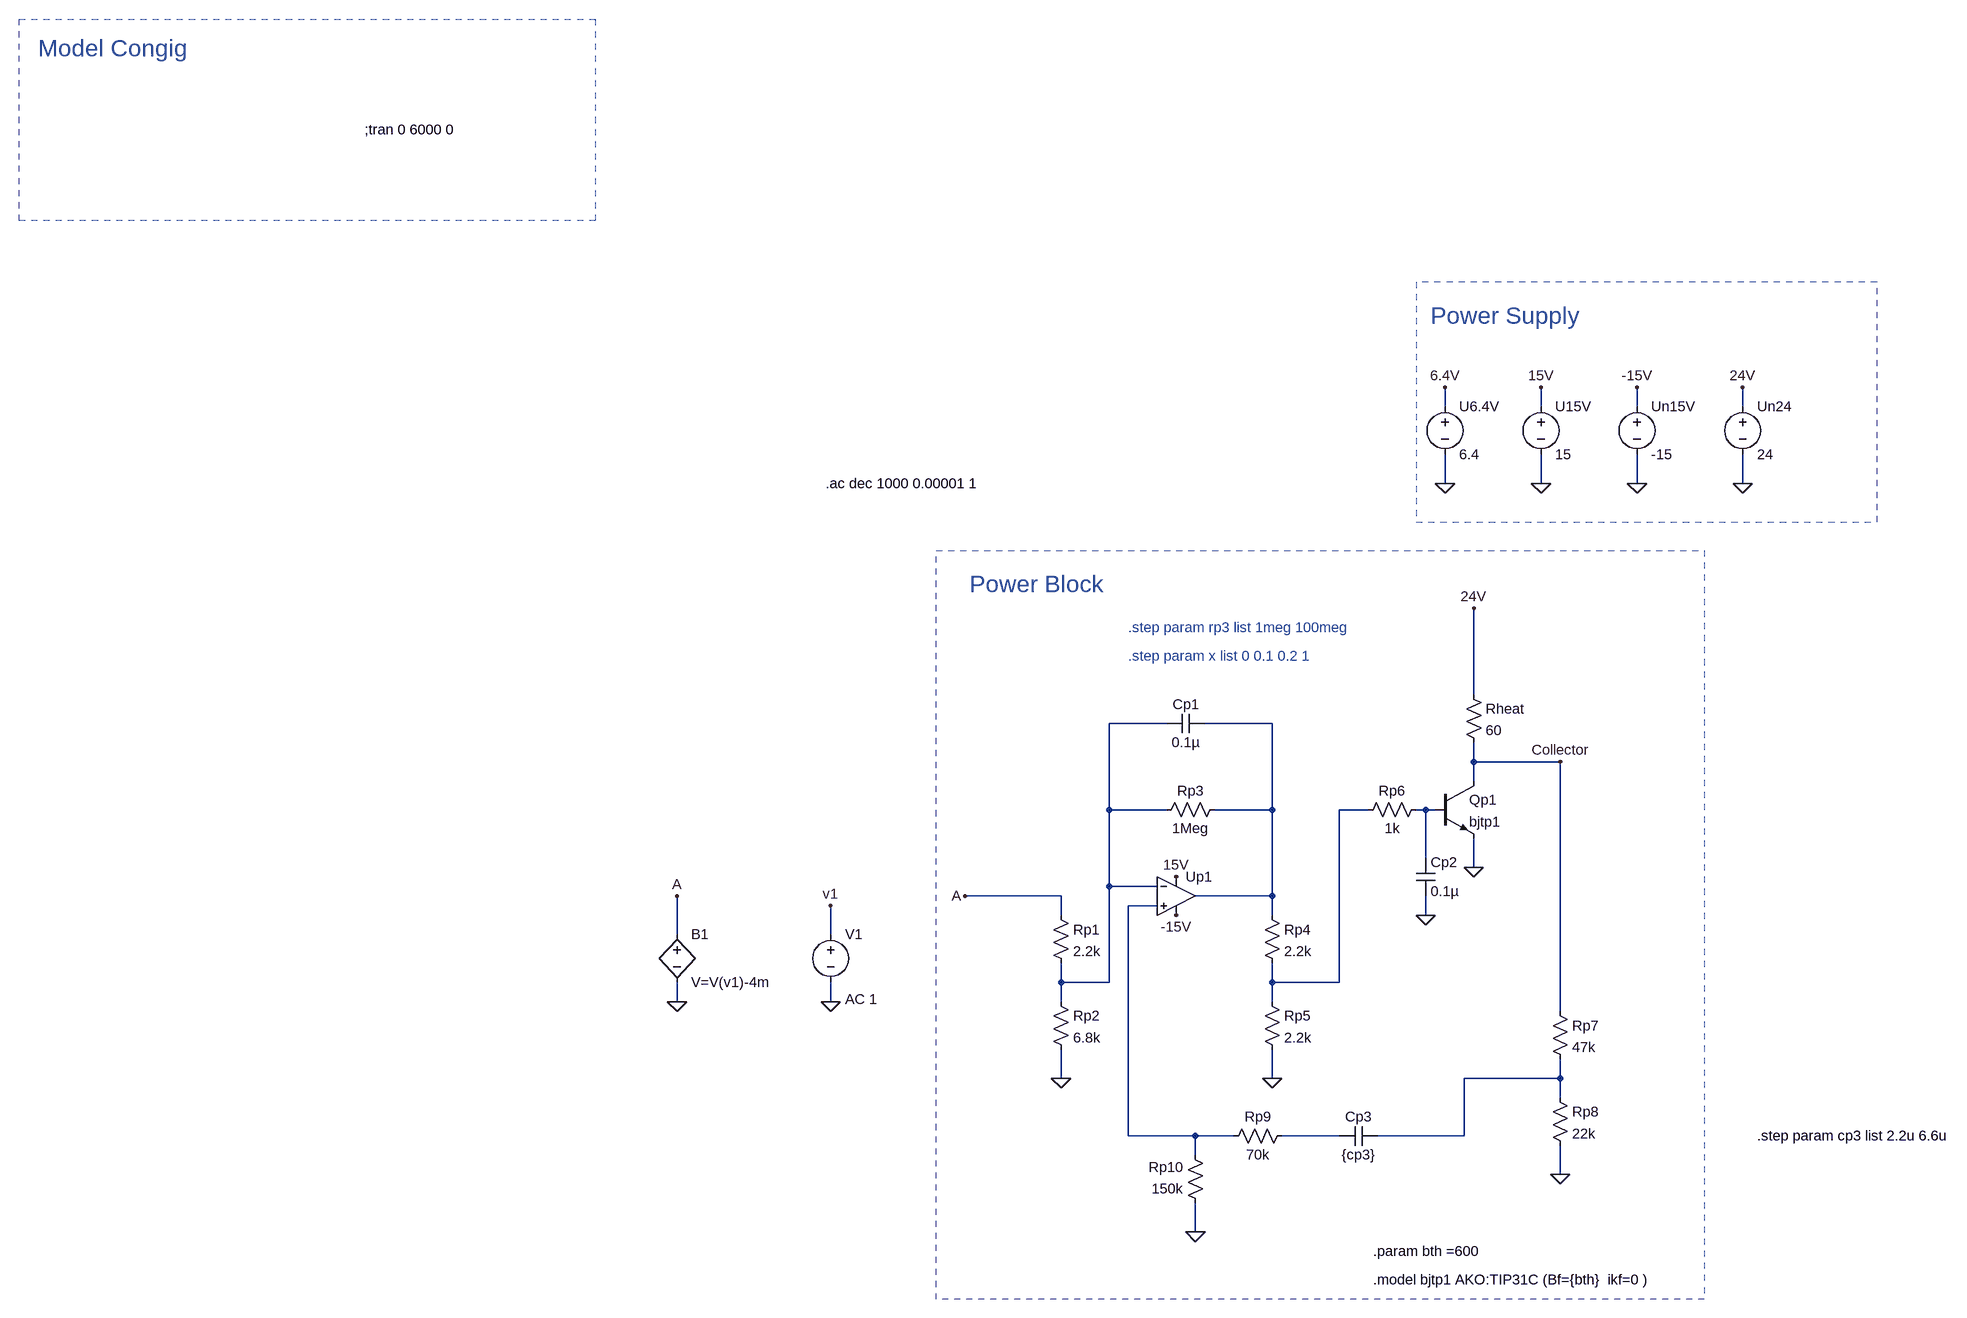
[diagram p0: schematic power_block_frequency_response.asc]
power_block_frequency_response.asc, the LTspice schematic file:
Version 4
SHEET 1 1512 1684
WIRE -208 -416 -208 -448
WIRE -48 -416 -48 -448
WIRE 112 -416 112 -448
WIRE 288 -416 288 -448
WIRE -208 -288 -208 -336
WIRE -48 -288 -48 -336
WIRE 112 -288 112 -336
WIRE 288 -288 288 -336
WIRE -160 64 -160 -80
WIRE -672 112 -768 112
WIRE -496 112 -608 112
WIRE -160 176 -160 144
WIRE -16 176 -160 176
WIRE -160 208 -160 176
WIRE -768 256 -768 112
WIRE -672 256 -768 256
WIRE -496 256 -496 112
WIRE -496 256 -592 256
WIRE -336 256 -384 256
WIRE -240 256 -256 256
WIRE -224 256 -240 256
WIRE -240 336 -240 256
WIRE -160 352 -160 304
WIRE -768 384 -768 256
WIRE -688 384 -768 384
WIRE -848 400 -1008 400
WIRE -496 400 -496 256
WIRE -496 400 -624 400
WIRE -688 416 -736 416
WIRE -848 432 -848 400
WIRE -496 432 -496 400
WIRE -240 432 -240 400
WIRE -1488 464 -1488 400
WIRE -1232 464 -1232 416
WIRE -848 544 -848 512
WIRE -768 544 -768 384
WIRE -768 544 -848 544
WIRE -496 544 -496 512
WIRE -384 544 -384 256
WIRE -384 544 -496 544
WIRE -1488 576 -1488 544
WIRE -1232 576 -1232 544
WIRE -848 576 -848 544
WIRE -496 576 -496 544
WIRE -16 592 -16 176
WIRE -848 704 -848 656
WIRE -496 704 -496 656
WIRE -16 704 -16 672
WIRE -16 704 -176 704
WIRE -16 736 -16 704
WIRE -736 800 -736 416
WIRE -624 800 -736 800
WIRE -560 800 -624 800
WIRE -384 800 -480 800
WIRE -176 800 -176 704
WIRE -176 800 -320 800
WIRE -624 832 -624 800
WIRE -16 864 -16 816
WIRE -624 960 -624 912
FLAG -208 -288 0
FLAG -208 -448 6.4V
FLAG -48 -288 0
FLAG -48 -448 15V
FLAG 112 -288 0
FLAG 112 -448 -15V
FLAG -848 704 0
FLAG -656 432 -15V
FLAG -656 368 15V
FLAG -496 704 0
FLAG -160 352 0
FLAG 288 -288 0
FLAG 288 -448 24V
FLAG -16 864 0
FLAG -624 960 0
FLAG -240 432 0
FLAG -16 176 Collector
FLAG -160 -80 24V
FLAG -1232 576 0
FLAG -1232 416 v1
FLAG -1488 576 0
FLAG -1488 400 A
FLAG -1008 400 A
DATAFLAG -496 128 ""
DATAFLAG -16 320 ""
DATAFLAG -848 544 ""
DATAFLAG -16 704 ""
SYMBOL voltage -208 -432 R0
WINDOW 123 0 0 Left 0
WINDOW 39 0 0 Left 0
SYMATTR InstName U6.4V
SYMATTR Value 6.4
SYMBOL voltage -48 -432 R0
WINDOW 123 0 0 Left 0
WINDOW 39 0 0 Left 0
SYMATTR InstName U15V
SYMATTR Value 15
SYMBOL voltage 112 -432 R0
WINDOW 123 0 0 Left 0
WINDOW 39 0 0 Left 0
SYMATTR InstName Un15V
SYMATTR Value -15
SYMBOL res -864 416 R0
SYMATTR InstName Rp1
SYMATTR Value 2.2k
SYMBOL res -864 560 R0
SYMATTR InstName Rp2
SYMATTR Value 6.8k
SYMBOL res -576 240 R90
WINDOW 0 0 56 VBottom 2
WINDOW 3 32 56 VTop 2
SYMATTR InstName Rp3
SYMATTR Value 1Meg
SYMBOL res -512 416 R0
SYMATTR InstName Rp4
SYMATTR Value 2.2k
SYMBOL res -512 560 R0
SYMATTR InstName Rp5
SYMATTR Value 2.2k
SYMBOL res -176 48 R0
SYMATTR InstName Rheat
SYMATTR Value 60
SYMBOL voltage 288 -432 R0
WINDOW 123 0 0 Left 0
WINDOW 39 0 0 Left 0
SYMATTR InstName Un24
SYMATTR Value 24
SYMBOL res -32 576 R0
SYMATTR InstName Rp7
SYMATTR Value 47k
SYMBOL res -32 720 R0
SYMATTR InstName Rp8
SYMATTR Value 22k
SYMBOL res -464 784 R90
WINDOW 0 0 56 VBottom 2
WINDOW 3 32 56 VTop 2
SYMATTR InstName Rp9
SYMATTR Value 70k
SYMBOL res -608 928 R180
WINDOW 0 36 76 Left 2
WINDOW 3 36 40 Left 2
SYMATTR InstName Rp10
SYMATTR Value 150k
SYMBOL res -240 240 R90
WINDOW 0 0 56 VBottom 2
WINDOW 3 32 56 VTop 2
SYMATTR InstName Rp6
SYMATTR Value 1k
SYMBOL cap -320 784 R90
WINDOW 0 0 32 VBottom 2
WINDOW 3 32 32 VTop 2
SYMATTR InstName Cp3
SYMATTR Value {cp3}
SYMBOL cap -608 96 R90
WINDOW 0 0 32 VBottom 2
WINDOW 3 32 32 VTop 2
SYMATTR InstName Cp1
SYMATTR Value 0.1µ
SYMBOL cap -256 336 R0
SYMATTR InstName Cp2
SYMATTR Value 0.1µ
SYMBOL npn -224 208 R0
SYMATTR InstName Qp1
SYMATTR Value bjtp1
SYMBOL Opamps\\UniversalOpamp2 -656 400 R0
SYMATTR InstName Up1
SYMATTR Value2 Avol=250k GBW=10Meg Slew=10Meg
SYMBOL voltage -1232 448 R0
WINDOW 123 24 124 Left 2
WINDOW 39 0 0 Left 0
SYMATTR Value2 AC 1
SYMATTR InstName V1
SYMATTR Value ""
SYMBOL bv -1488 448 R0
SYMATTR InstName B1
SYMATTR Value V=V(v1)-4m
TEXT -2080 -968 Left 2 !;tran 0 6000 0
TEXT -232 -568 Left 4 ;Power Supply
TEXT -1000 -120 Left 4 ;Power Block
TEXT -328 1040 Left 2 !.model bjtp1 AKO:TIP31C (Bf={bth}  ikf=0 )
TEXT -2624 -1104 Left 4 ;Model Congig
TEXT -328 992 Left 2 !.param bth =600
TEXT -736 0 Left 2 ;.step param x list 0 0.1 0.2 1
TEXT -736 -48 Left 2 ;.step param rp3 list 1meg 100meg
TEXT -1240 -288 Left 2 !.ac dec 1000 0.00001 1
TEXT 312 800 Left 2 !.step param cp3 list 2.2u 6.6u
RECTANGLE Normal 512 -624 -256 -224 2
RECTANGLE Normal 224 1072 -1056 -176 2
RECTANGLE Normal -1696 -816 -2656 -1152 2

The netlist it stands for:
* power_block_frequency_response.asc
V§U6.4V 6.4V 0 6.4
V§U15V 15V 0 15
V§Un15V -15V 0 -15
Rp1 A N001 2.2k
Rp2 N001 0 6.8k
Rp3 N002 N001 1Meg
Rp4 N002 N003 2.2k
Rp5 N003 0 2.2k
Rheat 24V Collector 60
V§Un24 24V 0 24
Rp7 Collector N006 47k
Rp8 N006 0 22k
Rp9 N007 N005 70k
Rp10 0 N005 150k
Rp6 N004 N003 1k
Cp3 N006 N007 {cp3}
Cp1 N002 N001 0.1µ
Cp2 N004 0 0.1µ
Qp1 Collector N004 0 0 bjtp1
XUp1 N005 N001 15V -15V N002 level.2 Avol=250k GBW=10Meg Slew=10Meg ilimit=25m rail=0 Vos=0 phimargin=45 en=0 enk=0 in=0 ink=0 Rin=500Meg  ; pins IN+ IN- V+ V- OUT
V1 v1 0 AC 1
B1 A 0 V=V(v1)-4m
.model NPN NPN
.model PNP PNP
.lib standard.bjt
;tran 0 6000 0
* Power Supply
* Power Block
.model bjtp1 AKO:TIP31C (Bf={bth}  ikf=0 )
* Model Congig
.param bth =600
* .step param x list 0 0.1 0.2 1
* .step param rp3 list 1meg 100meg
.ac dec 1000 0.00001 1
.step param cp3 list 2.2u 6.6u
.lib UniversalOpamps2.sub
.backanno
.end